# Altium schematic sheet ECU.SchDoc
size 420 x 297 mm
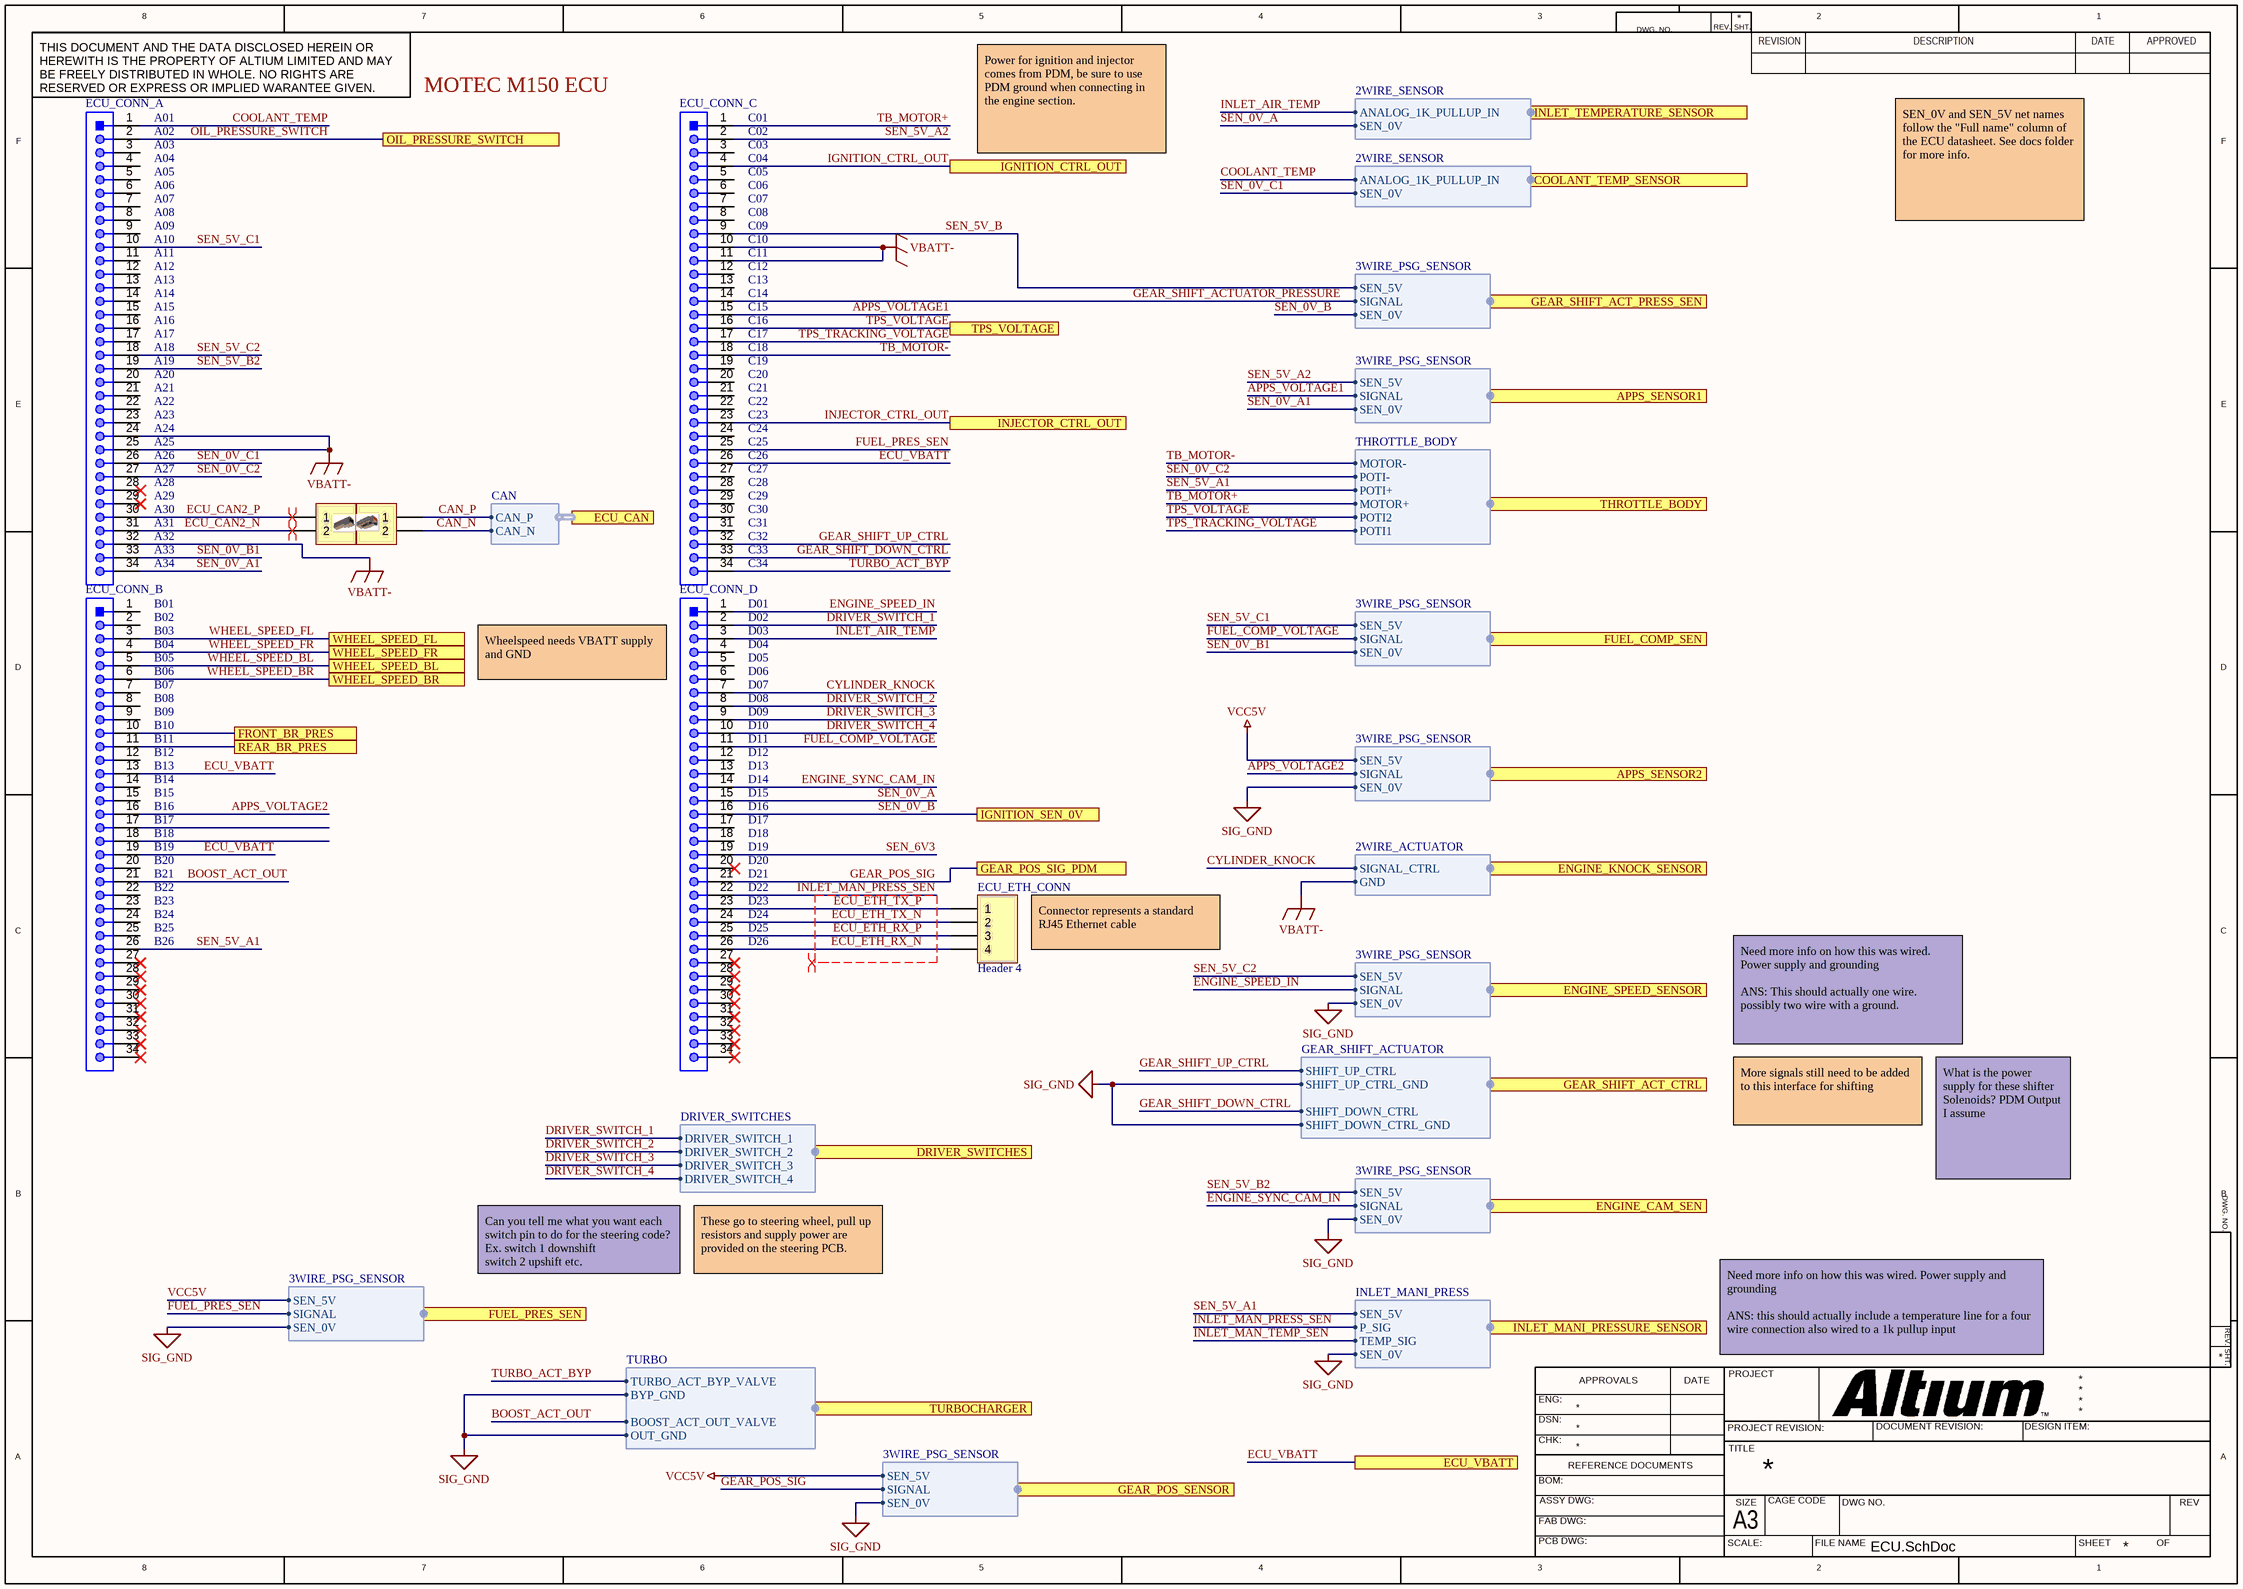
[diagram p0: ECU.SchDoc]

## Parts
ECU_CAN_CONNECTOR  Header 2  [HDR1X2]  (value not drawn)
ECU_CAN_CONNECTOR?  Header 2  [HDR1X2]  (value not drawn)
ECU_CONN_A  61303411021  [61303411021]  (value not drawn)
ECU_CONN_B  61303411021  [61303411021]  (value not drawn)
ECU_CONN_C  61303411021  [61303411021]  (value not drawn)
ECU_CONN_D  61303411021  [61303411021]  (value not drawn)
ECU_ETH_CONN  Header 4  [HDR1X4]

## Ports
APPS_SENSOR1 (harness 3WIRE_PSG_SENSOR), APPS_SENSOR2 (harness 3WIRE_PSG_SENSOR), COOLANT_TEMP_SENSOR (harness 2WIRE_SENSOR), DRIVER_SWITCHES (harness DRIVER_SWITCHES), ECU_CAN (harness CAN), ECU_VBATT, ENGINE_CAM_SEN (harness 3WIRE_PSG_SENSOR), ENGINE_KNOCK_SENSOR (harness 2WIRE_ACTUATOR), ENGINE_SPEED_SENSOR (harness 3WIRE_PSG_SENSOR), FRONT_BR_PRES, FUEL_COMP_SEN (harness 3WIRE_PSG_SENSOR), FUEL_PRES_SEN (harness 3WIRE_PSG_SENSOR), GEAR_POS_SENSOR (harness 3WIRE_PSG_SENSOR), GEAR_POS_SIG_PDM, GEAR_SHIFT_ACT_CTRL (harness GEAR_SHIFT_ACTUATOR), GEAR_SHIFT_ACT_PRESS_SEN (harness 3WIRE_PSG_SENSOR), IGNITION_CTRL_OUT, IGNITION_SEN_0V, INJECTOR_CTRL_OUT, INLET_MANI_PRESSURE_SENSOR (harness INLET_MANI_PRESS), INLET_TEMPERATURE_SENSOR (harness 2WIRE_SENSOR), OIL_PRESSURE_SWITCH, REAR_BR_PRES, THROTTLE_BODY (harness THROTTLE_BODY), TPS_VOLTAGE, TURBOCHARGER (harness TURBO), WHEEL_SPEED_BL, WHEEL_SPEED_BR, WHEEL_SPEED_FL, WHEEL_SPEED_FR

## Harnesses
CAN: CAN_P, CAN_N
2WIRE_SENSOR: ANALOG_1K_PULLUP_IN, SEN_0V
3WIRE_PSG_SENSOR: SEN_5V, SEN_0V, SIGNAL
2WIRE_ACTUATOR: SIGNAL_CTRL, GND
INLET_MANI_PRESS: SEN_5V, SEN_0V, P_SIG, TEMP_SIG
DRIVER_SWITCHES: DRIVER_SWITCH_1, DRIVER_SWITCH_2, DRIVER_SWITCH_3, DRIVER_SWITCH_4
THROTTLE_BODY: MOTOR+, MOTOR-, POTI1, POTI2, POTI-, POTI+
GEAR_SHIFT_ACTUATOR: SHIFT_UP_CTRL, SHIFT_DOWN_CTRL, SHIFT_UP_CTRL_GND, SHIFT_DOWN_CTRL_GND
TURBO: TURBO_ACT_BYP_VALVE, BOOST_ACT_OUT_VALVE, BYP_GND, OUT_GND

## Nets
SIG_GND: port ENGINE_SPEED_SENSOR.SEN_0V, port ENGINE_CAM_SEN.SEN_0V, port INLET_MANI_PRESSURE_SENSOR.SEN_0V, port GEAR_SHIFT_ACT_CTRL.SHIFT_UP_CTRL_GND, port GEAR_SHIFT_ACT_CTRL.SHIFT_DOWN_CTRL_GND, port TURBOCHARGER.BYP_GND, port TURBOCHARGER.OUT_GND, port APPS_SENSOR2.SEN_0V, port GEAR_POS_SENSOR.SEN_0V, port FUEL_PRES_SEN.SEN_0V
VBATT-: ECU_CONN_A.24 ECU_CONN_A.25 ECU_CONN_A.32 ECU_CONN_C.10 ECU_CONN_C.11 ; port ENGINE_KNOCK_SENSOR.GND
VCC5V: port APPS_SENSOR2.SEN_5V, port GEAR_POS_SENSOR.SEN_5V, port FUEL_PRES_SEN.SEN_5V
APPS_VOLTAGE1: ECU_CONN_C.15 ; port APPS_SENSOR1.SIGNAL
APPS_VOLTAGE2: ECU_CONN_B.16 ; port APPS_SENSOR2.SIGNAL
BOOST_ACT_OUT: ECU_CONN_B.21 ; port TURBOCHARGER.BOOST_ACT_OUT_VALVE
CAN_N: ECU_CAN_CONNECTOR?.2 ; port ECU_CAN.CAN_N
CAN_P: ECU_CAN_CONNECTOR?.1 ; port ECU_CAN.CAN_P
COOLANT_TEMP: ECU_CONN_A.1 ; port COOLANT_TEMP_SENSOR.ANALOG_1K_PULLUP_IN
CYLINDER_KNOCK: ECU_CONN_D.7 ; port ENGINE_KNOCK_SENSOR.SIGNAL_CTRL
DRIVER_SWITCH_1: ECU_CONN_D.2 ; port DRIVER_SWITCHES.DRIVER_SWITCH_1
DRIVER_SWITCH_2: ECU_CONN_D.8 ; port DRIVER_SWITCHES.DRIVER_SWITCH_2
DRIVER_SWITCH_3: ECU_CONN_D.9 ; port DRIVER_SWITCHES.DRIVER_SWITCH_3
DRIVER_SWITCH_4: ECU_CONN_D.10 ; port DRIVER_SWITCHES.DRIVER_SWITCH_4
ECU_CAN2_N: ECU_CAN_CONNECTOR.2 ECU_CONN_A.31
ECU_CAN2_P: ECU_CAN_CONNECTOR.1 ECU_CONN_A.30
ECU_ETH_RX_N: ECU_CONN_D.26 ECU_ETH_CONN.4
ECU_ETH_RX_P: ECU_CONN_D.25 ECU_ETH_CONN.3
ECU_ETH_TX_N: ECU_CONN_D.24 ECU_ETH_CONN.2
ECU_ETH_TX_P: ECU_CONN_D.23 ECU_ETH_CONN.1
ECU_VBATT: ECU_CONN_B.13 ECU_CONN_B.19 ECU_CONN_C.26 ; port ECU_VBATT
ENGINE_SPEED_IN: ECU_CONN_D.1 ; port ENGINE_SPEED_SENSOR.SIGNAL
ENGINE_SYNC_CAM_IN: ECU_CONN_D.14 ; port ENGINE_CAM_SEN.SIGNAL
FRONT_BR_PRES: ECU_CONN_B.10 ; port FRONT_BR_PRES
FUEL_COMP_VOLTAGE: ECU_CONN_D.11 ; port FUEL_COMP_SEN.SIGNAL
FUEL_PRES_SEN: ECU_CONN_C.25 ; port FUEL_PRES_SEN.SIGNAL
GEAR_POS_SIG: ECU_CONN_D.21 ; port GEAR_POS_SIG_PDM, port GEAR_POS_SENSOR.SIGNAL
GEAR_SHIFT_ACTUATOR_PRESSURE: ECU_CONN_C.14 ; port GEAR_SHIFT_ACT_PRESS_SEN.SIGNAL
GEAR_SHIFT_DOWN_CTRL: ECU_CONN_C.33 ; port GEAR_SHIFT_ACT_CTRL.SHIFT_DOWN_CTRL
GEAR_SHIFT_UP_CTRL: ECU_CONN_C.32 ; port GEAR_SHIFT_ACT_CTRL.SHIFT_UP_CTRL
IGNITION_CTRL_OUT: ECU_CONN_C.4 ; port IGNITION_CTRL_OUT
INJECTOR_CTRL_OUT: ECU_CONN_C.23 ; port INJECTOR_CTRL_OUT
INLET_AIR_TEMP: ECU_CONN_D.3 ; port INLET_TEMPERATURE_SENSOR.ANALOG_1K_PULLUP_IN
INLET_MAN_PRESS_SEN: ECU_CONN_D.22 ; port INLET_MANI_PRESSURE_SENSOR.P_SIG
INLET_MAN_TEMP_SEN: port INLET_MANI_PRESSURE_SENSOR.TEMP_SIG
OIL_PRESSURE_SWITCH: ECU_CONN_A.2 ; port OIL_PRESSURE_SWITCH
REAR_BR_PRES: ECU_CONN_B.11 ; port REAR_BR_PRES
SEN_0V_A: ECU_CONN_D.15 ; port INLET_TEMPERATURE_SENSOR.SEN_0V
SEN_0V_A1: ECU_CONN_A.34 ; port APPS_SENSOR1.SEN_0V
SEN_0V_B: ECU_CONN_D.16 ; port IGNITION_SEN_0V, port GEAR_SHIFT_ACT_PRESS_SEN.SEN_0V
SEN_0V_B1: ECU_CONN_A.33 ; port FUEL_COMP_SEN.SEN_0V
SEN_0V_C1: ECU_CONN_A.26 ; port COOLANT_TEMP_SENSOR.SEN_0V
SEN_0V_C2: ECU_CONN_A.27 ; port THROTTLE_BODY.POTI-
SEN_5V_A1: ECU_CONN_B.26 ; port INLET_MANI_PRESSURE_SENSOR.SEN_5V, port THROTTLE_BODY.POTI+
SEN_5V_A2: ECU_CONN_C.2 ; port APPS_SENSOR1.SEN_5V
SEN_5V_B: ECU_CONN_C.9 ; port GEAR_SHIFT_ACT_PRESS_SEN.SEN_5V
SEN_5V_B2: ECU_CONN_A.19 ; port ENGINE_CAM_SEN.SEN_5V
SEN_5V_C1: ECU_CONN_A.10 ; port FUEL_COMP_SEN.SEN_5V
SEN_5V_C2: ECU_CONN_A.18 ; port ENGINE_SPEED_SENSOR.SEN_5V
SEN_6V3: ECU_CONN_D.19
TB_MOTOR+: ECU_CONN_C.1 ; port THROTTLE_BODY.MOTOR+
TB_MOTOR-: ECU_CONN_C.18 ; port THROTTLE_BODY.MOTOR-
TPS_TRACKING_VOLTAGE: ECU_CONN_C.17 ; port THROTTLE_BODY.POTI1
TPS_VOLTAGE: ECU_CONN_C.16 ; port TPS_VOLTAGE, port THROTTLE_BODY.POTI2
TURBO_ACT_BYP: ECU_CONN_C.34 ; port TURBOCHARGER.TURBO_ACT_BYP_VALVE
WHEEL_SPEED_BL: ECU_CONN_B.5 ; port WHEEL_SPEED_BL
WHEEL_SPEED_BR: ECU_CONN_B.6 ; port WHEEL_SPEED_BR
WHEEL_SPEED_FL: ECU_CONN_B.3 ; port WHEEL_SPEED_FL
WHEEL_SPEED_FR: ECU_CONN_B.4 ; port WHEEL_SPEED_FR

Not connected (* = marked no-connect by the designer): ECU_CONN_A 3 4 5 6 7 8 9 11 12 13 14 15 16 17 20 21 22 23 28* 29*; ECU_CONN_B 1 2 7 8 9 12 14 15 17 18 20 22 23 24 25 27* 28* 29* 30* 31* 32* 33* 34*; ECU_CONN_C 3 5 6 7 8 12 13 19 20 21 22 24 27 28 29 30 31; ECU_CONN_D 4 5 6 12 13 17 18 20* 27* 28* 29* 30* 31* 32* 33* 34*

## Layout directives
differential pair: ECU_CAN2_N, ECU_CAN2_P, ECU_ETH_RX_N, ECU_ETH_RX_P, ECU_ETH_TX_N, ECU_ETH_TX_P, INLET_MAN_PRESS_SEN

## Notes on the sheet
- (near ECU_CONN_A) A01
- MOTEC M150 ECU
- (near ECU_CONN_C) C01
- (near ECU_CONN_A) A02
- (near ECU_CONN_A) A03
- (near ECU_CONN_A) A04
- (near ECU_CONN_A) A05
- (near ECU_CONN_A) A06
- (near ECU_CONN_C) C02
- (near ECU_CONN_C) C03
- (near ECU_CONN_C) C04
- (near ECU_CONN_C) C05
- (near ECU_CONN_C) C06
- Power for ignition and injector comes from PDM, be sure to use PDM ground when connecting in the engine section.
- (near ECU_CONN_A) A07
- (near ECU_CONN_A) A08
- (near ECU_CONN_A) A09
- (near ECU_CONN_A) A10
- (near ECU_CONN_A) A11
- (near ECU_CONN_C) C07
- (near ECU_CONN_C) C08
- (near ECU_CONN_C) C09
- (near ECU_CONN_C) C10
- (near ECU_CONN_C) C11
- SEN_0V and SEN_5V net names follow the "Full name" column of the ECU datasheet. See docs folder for more info.
- (near ECU_CONN_A) A12
- (near ECU_CONN_A) A13
- (near ECU_CONN_A) A14
- (near ECU_CONN_A) A15
- (near ECU_CONN_A) A16
- (near ECU_CONN_C) C12
- (near ECU_CONN_C) C13
- (near ECU_CONN_C) C14
- (near ECU_CONN_C) C15
- (near ECU_CONN_C) C16
- (near ECU_CONN_A) A17
- (near ECU_CONN_A) A18
- (near ECU_CONN_A) A19
- (near ECU_CONN_A) A20
- (near ECU_CONN_A) A21
- (near ECU_CONN_C) C17
- (near ECU_CONN_C) C18
- (near ECU_CONN_C) C19
- (near ECU_CONN_C) C20
- (near ECU_CONN_C) C21
- (near ECU_CONN_A) A22
- (near ECU_CONN_A) A23
- (near ECU_CONN_A) A24
- (near ECU_CONN_A) A25
- (near ECU_CONN_A) A26
- (near ECU_CONN_C) C22
- (near ECU_CONN_C) C23
- (near ECU_CONN_C) C24
- (near ECU_CONN_C) C25
- (near ECU_CONN_C) C26
- (near ECU_CONN_A) A27
- (near ECU_CONN_A) A28
- (near ECU_CONN_A) A29
- (near ECU_CONN_A) A30
- (near ECU_CONN_A) A31
- (near ECU_CONN_C) C27
- (near ECU_CONN_C) C28
- (near ECU_CONN_C) C29
- (near ECU_CONN_C) C30
- (near ECU_CONN_C) C31
- (near ECU_CONN_A) A32
- (near ECU_CONN_A) A33
- A34
- (near ECU_CONN_C) C32
- (near ECU_CONN_C) C33
- C34
- B01
- B02
- (near ECU_CONN_B) B03
- (near ECU_CONN_B) B04
- (near ECU_CONN_B) B05
- D01
- D02
- (near ECU_CONN_D) D03
- (near ECU_CONN_D) D04
- (near ECU_CONN_D) D05
- (near ECU_CONN_B) B06
- (near ECU_CONN_B) B07
- (near ECU_CONN_B) B08
- (near ECU_CONN_B) B09
- (near ECU_CONN_B) B10
- (near ECU_CONN_D) Wheelspeed needs VBATT supply and GND
- (near ECU_CONN_D) D06
- (near ECU_CONN_D) D07
- (near ECU_CONN_D) D08
- (near ECU_CONN_D) D09
- (near ECU_CONN_D) D10
- (near ECU_CONN_B) B11
- (near ECU_CONN_B) B12
- (near ECU_CONN_B) B13
- (near ECU_CONN_B) B14
- (near ECU_CONN_B) B15
- (near ECU_CONN_D) D11
- (near ECU_CONN_D) D12
- (near ECU_CONN_D) D13
- (near ECU_CONN_D) D14
- (near ECU_CONN_D) D15
- (near ECU_CONN_B) B16
- (near ECU_CONN_B) B17
- (near ECU_CONN_B) B18
- (near ECU_CONN_B) B19
- (near ECU_CONN_B) B20
- (near ECU_CONN_D) D16
- (near ECU_CONN_D) D17
- (near ECU_CONN_D) D18
- (near ECU_CONN_D) D19
- (near ECU_CONN_D) D20
- (near ECU_CONN_B) B21
- (near ECU_CONN_B) B22
- (near ECU_CONN_B) B23
- (near ECU_CONN_B) B24
- (near ECU_CONN_B) B25
- (near ECU_CONN_D) D21
- (near ECU_CONN_D) D22
- (near ECU_CONN_D) D23
- (near ECU_CONN_D) D24
- (near ECU_CONN_D) D25
- (near ECU_CONN_B) B26
- (near ECU_CONN_D) D26
- Connector represents a standard RJ45 Ethernet cable
- Need more info on how this was wired. Power supply and grounding
  ANS: This should actually one wire. possibly two wire with a ground.
- More signals still need to be added to this interface for shifting
- What is the power supply for these shifter Solenoids? PDM Output I assume
- Can you tell me what you want each switch pin to do for the steering code? Ex. switch 1 downshift
  switch 2 upshift etc.
- These go to steering wheel, pull up resistors and supply power are provided on the steering PCB.
- Need more info on how this was wired. Power supply and grounding
  ANS: this should actually include a temperature line for a four wire connection also wired to a 1k pullup input
- 8
- 7
- 6
- 5
- 4
- 3
- DWG. NO.
- REV.
- SHT.
- REVISION
- 2
- DESCRIPTION
- DATE
- 1
- APPROVED
- THIS DOCUMENT AND THE DATA DISCLOSED HEREIN OR HEREWITH IS THE PROPERTY OF ALTIUM LIMITED AND MAY BE FREELY DISTRIBUTED IN WHOLE. NO RIGHTS ARE RESERVED OR EXPRESS OR IMPLIED WARANTEE GIVEN.
- F
- E
- D
- C
- B
- ENG:
- APPROVALS
- PROJECT
- A
- DSN:
- CHK:
- REFERENCE DOCUMENTS
- PROJECT REVISION:
- TITLE
- DOCUMENT REVISION:
- DESIGN ITEM:
- BOM:
- FAB DWG:
- PCB DWG:
- ASSY DWG:
- SCALE:
- A3
- SIZE
- CAGE CODE
- FILE NAME
- DWG NO.
- SHEET
- OF
- REV

## Library data of the parts
ECU_CAN_CONNECTOR ECU_CAN_CONNECTOR? = Header 2: Header, 2-Pin; LatestRevisionDate: 17-Jul-2002; LatestRevisionNote: Re-released for DXP Platform.; Publisher: Altium Limited
ECU_CONN_A ECU_CONN_B ECU_CONN_C ECU_CONN_D = CMP-1502-01125-1: THT Angled Pin Header WR-PHD, Pitch 2.54 mm, Single Row, 34 pins; Manufacturer: Wurth Elektronik; Withstanding Voltage: 500VAC; Pin Number: 34; Rated Current: 3A; Gender: Male; Pitch: 2.54mm; Working Voltage: 250VAC; Contact Resistance: 20mOhm; Orientation: Angled; Mounting Technology: THT; Package Reference: 61303411021; Part Number: 61303411021; Datasheet URL: https://katalog.we-online.de/em/datasheet/6130xx11021.pdf; Publisher: WurthElektronik; Row Number: Single; Operating Temperature: -40to105degC; Packaging: Bag; Manufacturer URL: http://www.we-online.de
ECU_ETH_CONN = Header 4: Header, 4-Pin; LatestRevisionDate: 17-Jul-2002; LatestRevisionNote: Re-released for DXP Platform.; Publisher: Altium Limited